# EAGLE schematic LEDboard (EAGLE 9.5.2)
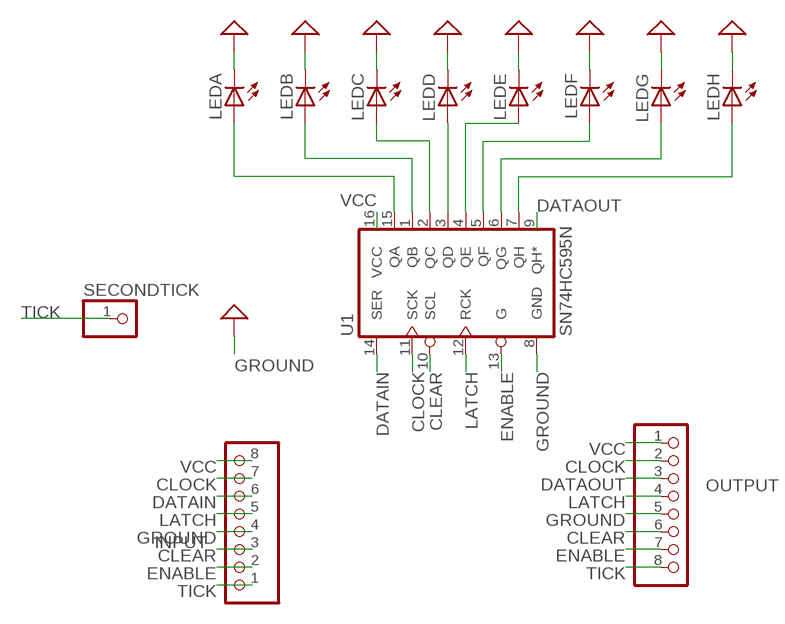
[diagram p0: schematic, sheet 1]

## Parts
INPUT  PINHD-1X8/90  [1X08/90]
LEDA  LED5MM  [LED5MM]
LEDB  LED5MM  [LED5MM]
LEDC  LED5MM  [LED5MM]
LEDD  LED5MM  [LED5MM]
LEDE  LED5MM  [LED5MM]
LEDF  LED5MM  [LED5MM]
LEDG  LED5MM  [LED5MM]
LEDH  LED5MM  [LED5MM]
OUTPUT  PINHD-1X8/90  [1X08/90]
SECONDTICK  PINHD-1X1  [1X01]
U1  SN74HC595N  74HC595N  [DIP16]

## Nets
CLEAR: INPUT.3 OUTPUT.6 U1.10(SCL)
CLOCK: INPUT.7 OUTPUT.2 U1.11(SCK)
DATAIN: INPUT.6 U1.14(SER)
DATAOUT: OUTPUT.3 U1.9(QH*)
ENABLE: INPUT.2 OUTPUT.7 U1.13(G)
GND: LEDA.K(C) LEDB.K(C) LEDC.K(C) LEDD.K(C) LEDE.K(C) LEDF.K(C) LEDG.K(C) LEDH.K(C) ; supply symbol labelled SUP
GROUND: INPUT.4 OUTPUT.5 U1.8(GND) ; supply symbol labelled SUP
LATCH: INPUT.5 OUTPUT.4 U1.12(RCK)
N$1: LEDD.A U1.3(QD)
N$2: LEDA.A U1.15(QA)
N$9: LEDB.A U1.1(QB)
N$17: LEDC.A U1.2(QC)
N$19: LEDE.A U1.4(QE)
N$20: LEDF.A U1.5(QF)
N$21: LEDG.A U1.6(QG)
N$22: LEDH.A U1.7(QH)
TICK: INPUT.1 OUTPUT.8 SECONDTICK.1
VCC: INPUT.8 OUTPUT.1 U1.16(VCC)

## Library data of the parts
INPUT OUTPUT = pinhead:PINHD-1X8: PIN HEADER
LEDA LEDB LEDC LEDD LEDE LEDF LEDG LEDH = adafruit:LED: LED OSRAM: - CHIPLED LG R971, LG N971, LY N971, LG Q971, LY Q971, LO R971, LY R971 LH N974, LH R974 LS Q976, LO Q976, LY Q976 LO Q996 - Hyper CHIPLED LW Q18S LB Q993, LB Q99A, LB R99A - SideLED LS A670, LO A670, LY A670, LG A670, LP A670 LB A673, LV A673, LT A673, LW A673 LH A674 LY A675 LS A676, LA A676, LO A676, LY A676, LW A676 LS A679, LY A679, LG A679 - Hyper Micro SIDELED® LS Y876, LA Y876, LO Y876, LY Y876 LT Y87S - SmartLED LW L88C, LW L88S LB L89C, LB L89S, LG L890 LS L89K, LO L89K, LY L89K LS L896, LA L896, LO L896, LY L896 - TOPLED LS T670, LO T670, LY T670, LG T670, LP T670 LSG T670, LSP T670, LSY T670, LOP T670, LYG T670 LG T671, LOG T671, LSG T671 LB T673, LV T673, LT T673, LW T673 LH T674 LS T676, LA T676, LO T676, LY T676, LB T676, LH T676, LSB T676, LW T676 LB T67C, LV T67C, LT T67C, LS T67K, LO T67K, LY T67K, LW E67C LS E67B, LA E67B, LO E67B, LY E67B, LB E67C, LV E67C, LT E67C LW T67C LS T679, LY T679, LG T679 LS T770, LO T770, LY T770, LG T770, LP T770 LB T773, LV T773, LT T773, LW T773 LH T774 LS E675, LA E675, LY E675, LS T675 LS T776, LA T776, LO T776, LY T776, LB T776 LHGB T686 LT T68C, LB T68C - Hyper Mini TOPLED® LB M676 - Mini TOPLED Santana® LG M470 LS M47K, LO M47K, LY M47K Source: http://www.osram.convergy.de/
SECONDTICK = adafruit:PINHD-1X1: Pin header 1x1 for 0.1" spacing With round pins
U1 = SparkFun-IC-Logic:74*595: 8-Bit Shift Register (Serial to Parallel) Datasheet <http://cdn.sparkfun.com/datasheets/BreakoutBoards/MM74HC595.pdf> SparkFun Products SparkFun Shift Register Breakout - 74HC595 <https://www.sparkfun.com/products/10680> (BOB-10680); PROD_ID: IC-13123

## Net classes
0 default: width 0.254 mm, clearance 0.127 mm